# Altium schematic sheet NRF9160.SchDoc
size A3; SheetNumber: 2; SheetTotal: 6
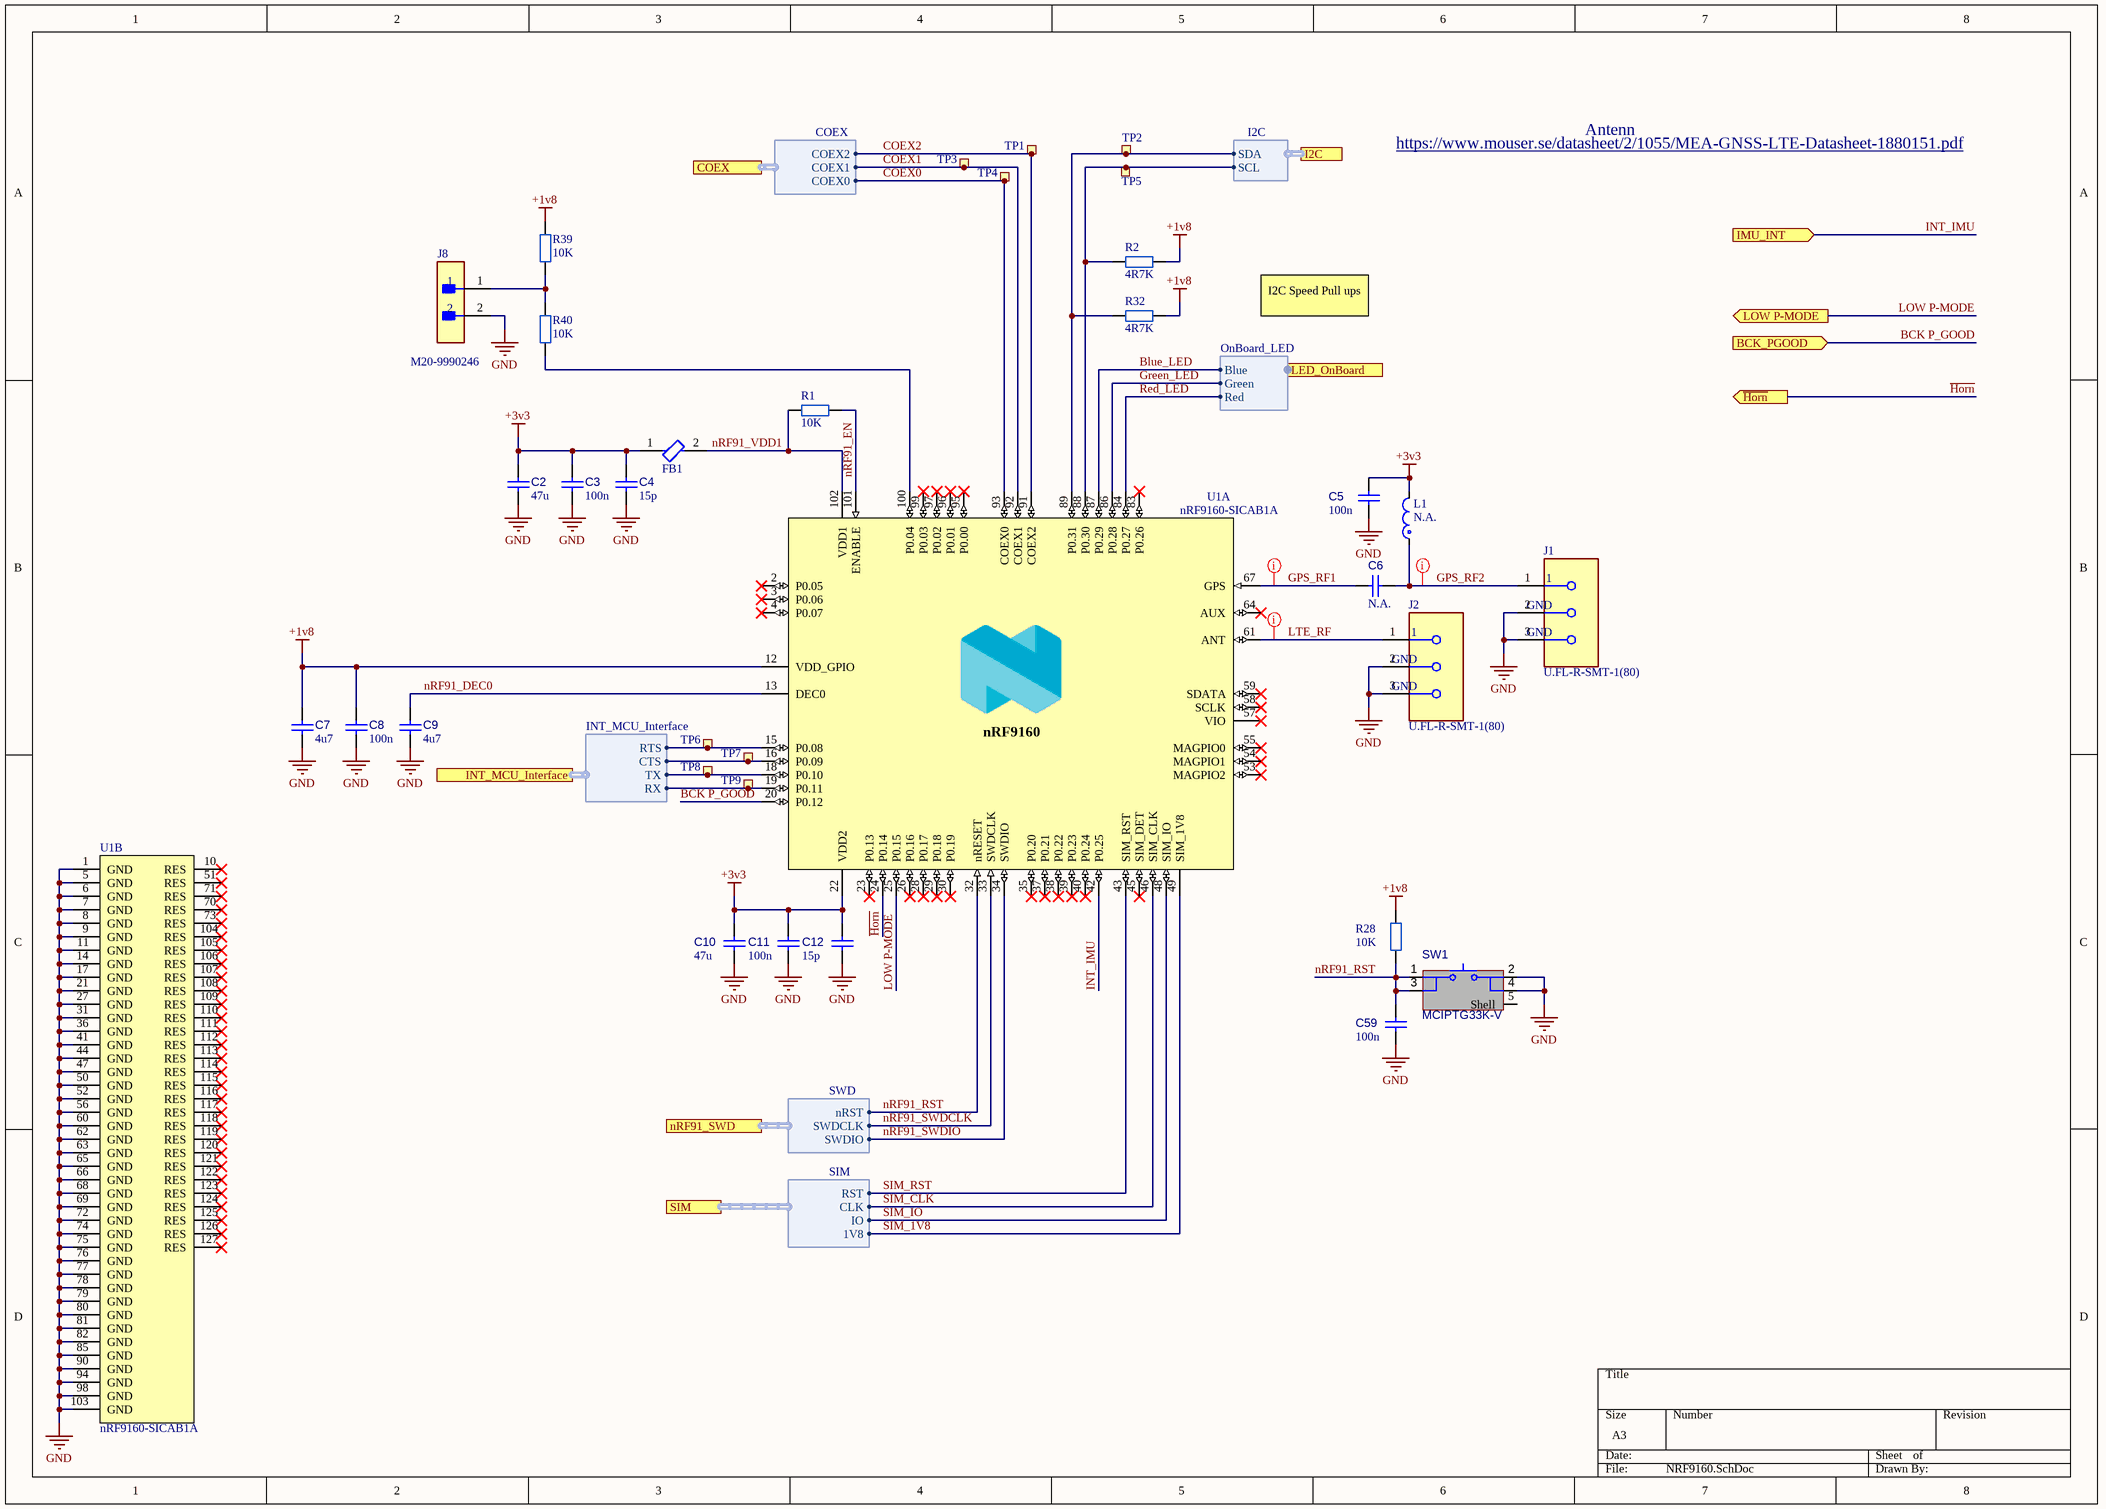
[diagram p0: NRF9160.SchDoc]

## Parts
C2  value 47u  [CAPC2013X95X50LL10T25 HD]  (hidden comment: Capacitor 0805)
C3  value 100n  [CAPC1005X55X25LL05T10 HD]  (hidden comment: Capacitor 0402)
C4  value 15p  [CAPC1005X55X25LL05T10 HD]  (hidden comment: Capacitor 0402)
C5  value 100n  [CAPC1005X55X25LL05T10 HD]  (hidden comment: Capacitor 0402)
C6  value N.A.  [CAPC1005X55X25LL05T10 HD]  (hidden comment: Capacitor 0402)
C7  value 4u7  [CAPC1608X90X40LL10T20 HD]  (hidden comment: Capacitor 0603)
C8  value 100n  [CAPC1005X55X25LL05T10 HD]  (hidden comment: Capacitor 0402)
C9  value 4u7  [CAPC1608X90X40LL10T20 HD]  (hidden comment: Capacitor 0603)
C10  value 47u  [CAPC2013X95X50LL10T25 HD]  (hidden comment: Capacitor 0805)
C11  value 100n  [CAPC1005X55X25LL05T10 HD]  (hidden comment: Capacitor 0402)
C12  value 15p  [CAPC1005X55X25LL05T10 HD]  (hidden comment: Capacitor 0402)
C59  value 100n  [CAPC1005X55X25LL05T10 HD]  (hidden comment: Capacitor 0402)
FB1  BLM15PX121SN1D  [FP-BLM15-0_05-d0_7-IPC_A]  (value not drawn)
J1  U.FL-R-SMT-1(80)  [FP-U_FL-R-SMT-1_80-MFG]
J2  U.FL-R-SMT-1(80)  [FP-U_FL-R-SMT-1_80-MFG]
J8  M20-9990246  [FP-M20-9990246-MFG]
L1  value N.A.  [INDC1005X55X25LL05T10_A]  (hidden comment: Inductor 0402)
R1  value 10K  [RESC1005X40X25LL10T10 HD]  (hidden comment: Resistor 0403)
R2  value 4R7K  [RESC1005X40X25LL10T10 HD]  (hidden comment: Resistor 0403)
R28  value 10K  [RESC1005X40X25LL10T10 HD]  (hidden comment: Resistor 0403)
R32  value 4R7K  [RESC1005X40X25LL10T10 HD]  (hidden comment: Resistor 0403)
R39  value 10K  [RESC1005X40X25LL10T10 HD]  (hidden comment: Resistor 0403)
R40  value 10K  [RESC1005X40X25LL10T10 HD]  (hidden comment: Resistor 0403)
SW1  MCIPTG33K-V  [MCIPTG33K-V-Footprint-1]
TP1  TP_SMD_Ø0.7MM  [TP_SMD_Ø0.7mm]  (value not drawn)  (no BOM)
TP2  TP_SMD_Ø0.7MM  [TP_SMD_Ø0.7mm]  (value not drawn)  (no BOM)
TP3  TP_SMD_Ø0.7MM  [TP_SMD_Ø0.7mm]  (value not drawn)  (no BOM)
TP4  TP_SMD_Ø0.7MM  [TP_SMD_Ø0.7mm]  (value not drawn)  (no BOM)
TP5  TP_SMD_Ø0.7MM  [TP_SMD_Ø0.7mm]  (value not drawn)  (no BOM)
TP6  TP_SMD_Ø0.7MM  [TP_SMD_Ø0.7mm]  (value not drawn)  (no BOM)
TP7  TP_SMD_Ø0.7MM  [TP_SMD_Ø0.7mm]  (value not drawn)  (no BOM)
TP8  TP_SMD_Ø0.7MM  [TP_SMD_Ø0.7mm]  (value not drawn)  (no BOM)
TP9  TP_SMD_Ø0.7MM  [TP_SMD_Ø0.7mm]  (value not drawn)  (no BOM)
U1  nRF9160-SICAB1A  [LGA50P1600X1050X104-161N]  (parts A,B of 2)

## Ports
BCK_PGOOD (in), COEX (harness COEX), I2C (harness I2C), IMU_INT (in), INT_MCU_Interface (harness INT_MCU_Interface), LED_OnBoard (harness OnBoard_LED), LOW P-MODE (out), nRF91_SWD (harness SWD), SIM (harness SIM), ~{Horn} (out)

## Harnesses
SIM: RST, CLK, IO, 1V8
SWD: nRST, SWDCLK, SWDIO
COEX: COEX0, COEX1, COEX2
I2C: SDA, SCL
INT_MCU_Interface: RTS, CTS, TX, RX
OnBoard_LED: Blue, Green, Red

## Nets
+1v8: C7.2 C8.2 R2.2 R28.2 R32.2 R39.1 U1.12(VDD_GPIO)
+3v3: C2.2 C3.2 C4.2 C5.1 C10.2 C11.2 C12.2 FB1.1 L1.2 U1.22(VDD2)
GND: C2.1 C3.1 C4.1 C5.2 C7.1 C8.1 C9.1 C10.1 C11.1 C12.1 C59.1 J1.2(GND) J1.3(GND) J2.2(GND) J2.3(GND) J8.2 SW1.2 SW1.4 U1.1(GND) U1.5(GND) U1.6(GND) U1.7(GND) U1.8(GND) U1.9(GND) U1.11(GND) U1.14(GND) U1.17(GND) U1.21(GND) U1.27(GND) U1.31(GND) U1.36(GND) U1.41(GND) U1.44(GND) U1.47(GND) U1.50(GND) U1.52(GND) U1.56(GND) U1.60(GND) U1.62(GND) U1.63(GND) U1.65(GND) U1.66(GND) U1.68(GND) U1.69(GND) U1.72(GND) U1.74(GND) U1.75(GND) U1.76(GND) U1.77(GND) U1.78(GND) U1.79(GND) U1.80(GND) U1.81(GND) U1.82(GND) U1.85(GND) U1.90(GND) U1.94(GND) U1.98(GND) U1.103(GND)
BCK P_GOOD: U1.20(P0.12) ; port BCK_PGOOD
Blue_LED: U1.87(P0.29) ; port LED_OnBoard.Blue
COEX0: TP4.1 U1.93(COEX0) ; port COEX.COEX0
COEX1: TP3.1 U1.92(COEX1) ; port COEX.COEX1
COEX2: TP1.1 U1.91(COEX2) ; port COEX.COEX2
GPS_RF1: C6.2 U1.67(GPS)
GPS_RF2: C6.1 J1.1 L1.1
Green_LED: U1.86(P0.28) ; port LED_OnBoard.Green
~{Horn}: U1.24(P0.14) ; port ~{Horn}
INT_IMU: U1.42(P0.25) ; port IMU_INT
LOW P-MODE: U1.25(P0.15) ; port LOW P-MODE
LTE_RF: J2.1 U1.61(ANT)
nRF91_DEC0: C9.2 U1.13(DEC0)
nRF91_EN: R1.1 U1.101(ENABLE)
nRF91_RST: C59.2 R28.1 SW1.1 SW1.3 U1.32(nRESET) ; port nRF91_SWD.nRST
nRF91_SWDCLK: U1.33(SWDCLK)
nRF91_SWDIO: U1.34(SWDIO)
nRF91_VDD1: FB1.2 R1.2 U1.102(VDD1)
Red_LED: U1.84(P0.27) ; port LED_OnBoard.Red
SIM_1V8: U1.49(SIM_1V8) ; port SIM.1V8
SIM_CLK: U1.46(SIM_CLK) ; port SIM.CLK
SIM_IO: U1.48(SIM_IO) ; port SIM.IO
SIM_RST: U1.43(SIM_RST) ; port SIM.RST
NetJ8_1: J8.1 R39.2 R40.2
NetR2_1: R2.1 TP5.1 U1.88(P0.30) ; port I2C.SCL
NetR32_1: R32.1 TP2.1 U1.89(P0.31) ; port I2C.SDA
NetR40_1: R40.1 U1.100(P0.04)
NetTP6_1: TP6.1 U1.15(P0.08) ; port INT_MCU_Interface.RTS
NetTP7_1: TP7.1 U1.16(P0.09) ; port INT_MCU_Interface.CTS
NetTP8_1: TP8.1 U1.18(P0.10) ; port INT_MCU_Interface.TX
NetTP9_1: TP9.1 U1.19(P0.11) ; port INT_MCU_Interface.RX

Not connected (* = marked no-connect by the designer): SW1 5(Shell); U1 2(P0.05)* 3(P0.06)* 4(P0.07)* 10(RES)* 23(P0.13)* 26(P0.16)* 28(P0.17)* 29(P0.18)* 30(P0.19)* 35(P0.20)* 37(P0.21)* 38(P0.22)* 39(P0.23)* 40(P0.24)* 45(SIM_DET)* 51(RES)* 53(MAGPIO2)* 54(MAGPIO1)* 55(MAGPIO0)* 57(VIO)* 58(SCLK)* 59(SDATA)* 64(AUX)* 70(RES)* 71(RES)* 73(RES)* 83(P0.26)* 95(P0.00)* 96(P0.01)* 97(P0.02)* 99(P0.03)* 104(RES)* 105(RES)* 106(RES)* 107(RES)* 108(RES)* 109(RES)* 110(RES)* 111(RES)* 112(RES)* 113(RES)* 114(RES)* 115(RES)* 116(RES)* 117(RES)* 118(RES)* 119(RES)* 120(RES)* 121(RES)* 122(RES)* 123(RES)* 124(RES)* 125(RES)* 126(RES)* 127(RES)*

## Layout directives
net class RF: GPS_RF1, GPS_RF2, LTE_RF

## Notes on the sheet
- https://www.mouser.se/datasheet/2/1055/MEA-GNSS-LTE-Datasheet-1880151.pdf
- Antenn
- I2C Speed Pull ups
- (in symbol CMP-026-000000-2, part A) nRF9160

## Library data of the parts
C2 C10 = CMP-001-00018-14: Chip Capacitor, 0805 (2012 Metric); Voltage Rating: ?V; Capacitor Type: Ceramic; Tolerance: ?%; Pins: 2; Min Operating Temperature: -55°C; Case/Package: 0805; Mounting Technology: SMT; Max Operating Temperature: 125°C
C3-C6 C8 C11 C12 C59 = CMP-001-00008-14: Chip Capacitor, 0402 (1005 Metric); Tolerance: ?%; Capacitor Type: Ceramic; Voltage Rating: ?V; Case/Package: 0402; Pins: 2; Mounting Technology: SMT
C7 C9 = CMP-001-00014-13: Chip Capacitor, 0603 (1608 Metric); Voltage Rating: ?V; Tolerance: ?%; Max Operating Temperature: Ceramic; Pins: 2; Case/Package: 0603; Mounting Technology: SMT
FB1 = CMP-006-00021-1: Ferrite Beads Multi-Layer 120Ohm 25% 100MHz 2A 0.055Ohm DCR 0402 T/R
J1 J2 = CMP-000007-1: CONN U.FL RCPT STR 50 OHM SMD
J8 = CMP-15831-000009-1: CONN HEADER VERT 2POS 2.54MM; Manufacturer: Harwin; Conn Gender: Male; Conn Orientation: Vertical; Number Of Contacts: 2; Current Rating: 3A; ComponentLink2URL: https://cdn.harwin.com/pdfs/M20-999.pdf; ComponentLink2Description: Datasheet; Package: M20-9990246; Temperature: -40°C to +105°C; Octopart: https://octopart.com/m20-9990246-harwin-2590635; Mouser Description: 2.54mm (0.1") Pitch SIL Vertical PC Tail Pin Header, 6.1mm mating pin height, tin, 2 contacts; Temperature Range High: +105°C; Device Class L1: Connectors; RoHS: TRUE; Automotive: No; Height: 8.99mm; Number Of Rows: 1; Contact Material: Tin,Nickel; Category: Conn; Pitch: 2.54mm; Lead Free: Yes; Digikey Description: CONN HEADER VERT 2POS 2.54MM; Manufacturer Part Number: M20-9990246; Temperature Range Low: -40°C; Device Class L3: unset; Device Class L2: Headers and Wire Housings
L1 = CMP-000000-6: Inductor RF Chip Thin Film 0402; Current Rating: ?A; Resonant Frequency: ?Hz; Inductance: N.A.; Pins: 2
R1 R2 R28 R32 R39 R40 = CMP-009-00178-4: Package: 0403; Design Item ID: Resistor EU; Source: Moto Symbol Lib.SchLib
SW1 = CMP-011-00014-2: The MCIPTG33K-V is a Tactile Switch with solder terminal. The 2.8 x 3.8mm vertical push series switch has silver plated stainless steel contact, high-temperature thermoplastic LCP stem and silver plated stainless steel cover.; ComponentLink1URL: https://www.farnell.com/datasheets/3167256.pdf; ComponentLink1Description: Link
TP1-TP9 = CMP-025-000000-1: 0.7mm circular SMD testpad; Manufacturer: Nordic Semiconductor; Artikkelnr Noca: N.A.; Value: Ø0.7mm,SMD; Pad Count: 1; ComponentLink1Description: Datasheet; Component Class: Connectors; Part Number: TP_SMD_Ø0.7MM; HelpURL: N.A.; Source: pca20035.SCHLIB; Published: 2017-12-14; ComponentLink1URL: N.A.; Note: N.A.; Pin Count: 1; Component Type: Standard (No BOM); Design Item ID: TP_SMD_Ø0.7MM; Part number IPS: N.A.; PartId: 100500474; LatestRevisionDate: 2017-12-14; Manufacturer Part Number: N.A.; ComponentLink2URL: N.A.; ComponentLink2Description: Supplier link; Footprint Doc: TP_SMD_Ø0.7mm
U1 = CMP-026-000000-2: Low power System-in-Package with integrated LTE-M/NB-IoT modem and GPS; Part number IPS: 80000002329; Manufacturer: Nordic Semiconductor; Artikkelnr Noca: N.A.; Pad Count: 161; HelpURL: N.A.; Source: pca20035.SCHLIB; Value: nRF9160-SICAB1A; Part Number: nRF9160-SICAB1A; PartId: 102000165; Component Class: nRF_Devices; Manufacturer Part Number: nRF9160-SICAB1A; ComponentLink1URL: N.A.; Footprint Doc: LGA-161; Published: 2020-08-13; Design Item ID: nRF9160-SICAB1A; Note: N.A.; ComponentLink1Description: Datasheet; Component Type: Standard; LatestRevisionDate: 2020-08-13; ComponentLink2URL: N.A.; Pin Count: 127; ComponentLink2Description: Supplier link